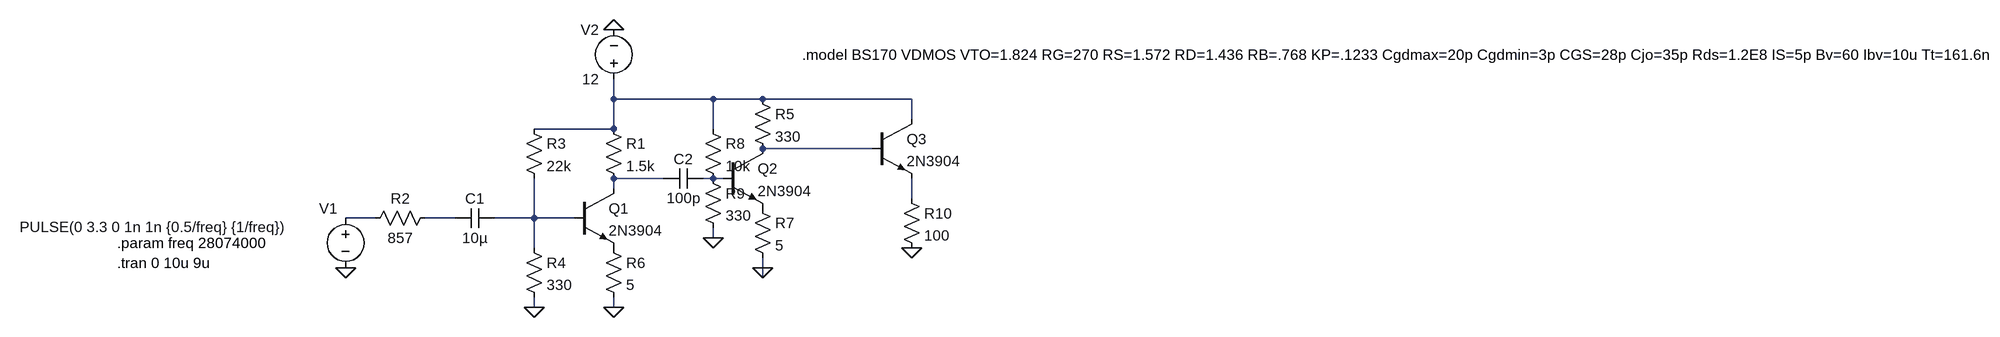
[diagram p0: schematic Draft2.asc]
Draft2.asc, the LTspice schematic file:
Version 4
SHEET 1 2568 680
WIRE 224 -48 224 -80
WIRE 384 -48 224 -48
WIRE 464 -48 384 -48
WIRE 704 -48 464 -48
WIRE 704 -16 704 -48
WIRE 224 0 224 -48
WIRE 224 0 96 0
WIRE 384 0 384 -48
WIRE 640 32 464 32
WIRE 304 80 224 80
WIRE 384 80 368 80
WIRE 400 80 384 80
WIRE 224 96 224 80
WIRE 704 112 704 80
WIRE -160 144 -208 144
WIRE -32 144 -80 144
WIRE 96 144 96 80
WIRE 96 144 32 144
WIRE 160 144 96 144
WIRE 384 176 384 160
WIRE 96 192 96 144
WIRE 464 224 464 208
WIRE 464 240 464 224
WIRE 96 288 96 272
WIRE 224 288 224 272
FLAG -208 224 0
FLAG 224 -160 0
FLAG 224 288 0
FLAG 96 288 0
FLAG 464 224 0
FLAG 384 176 0
FLAG 704 192 0
SYMBOL npn 160 96 R0
SYMATTR InstName Q1
SYMATTR Value 2N3904
SYMBOL res 208 -16 R0
SYMATTR InstName R1
SYMATTR Value 1.5k
SYMBOL voltage -208 128 R0
WINDOW 0 -43 0 Left 2
WINDOW 3 -525 30 Left 2
WINDOW 123 0 0 Left 0
WINDOW 39 0 0 Left 0
SYMATTR InstName V1
SYMATTR Value PULSE(0 3.3 0 1n 1n {0.5/freq} {1/freq})
SYMBOL voltage 224 -64 R180
WINDOW 0 24 96 Left 2
WINDOW 3 24 16 Left 2
WINDOW 123 0 0 Left 0
WINDOW 39 0 0 Left 0
SYMATTR InstName V2
SYMATTR Value 12
SYMBOL res 208 176 R0
SYMATTR InstName R6
SYMATTR Value 5
SYMBOL cap 32 128 R90
WINDOW 0 0 32 VBottom 2
WINDOW 3 32 32 VTop 2
SYMATTR InstName C1
SYMATTR Value 10µ
SYMBOL res -64 128 R90
WINDOW 0 0 56 VBottom 2
WINDOW 3 32 56 VTop 2
SYMATTR InstName R2
SYMATTR Value 857
SYMBOL res 80 -16 R0
SYMATTR InstName R3
SYMATTR Value 22k
SYMBOL res 80 176 R0
SYMATTR InstName R4
SYMATTR Value 330
SYMBOL npn 400 32 R0
SYMATTR InstName Q2
SYMATTR Value 2N3904
SYMBOL res 448 -64 R0
SYMATTR InstName R5
SYMATTR Value 330
SYMBOL res 448 112 R0
SYMATTR InstName R7
SYMATTR Value 5
SYMBOL cap 368 64 R90
WINDOW 0 0 32 VBottom 2
WINDOW 3 32 32 VTop 2
SYMATTR InstName C2
SYMATTR Value 100p
SYMBOL res 368 -16 R0
SYMATTR InstName R8
SYMATTR Value 10k
SYMBOL res 368 64 R0
SYMATTR InstName R9
SYMATTR Value 330
SYMBOL npn 640 -16 R0
SYMATTR InstName Q3
SYMATTR Value 2N3904
SYMBOL res 688 96 R0
SYMATTR InstName R10
SYMATTR Value 100
TEXT -576 216 Left 2 !.tran 0 10u 9u
TEXT -576 184 Left 2 !.param freq 28074000
TEXT 528 -120 Left 2 !.model BS170 VDMOS VTO=1.824 RG=270 RS=1.572 RD=1.436 RB=.768 KP=.1233 Cgdmax=20p Cgdmin=3p CGS=28p Cjo=35p Rds=1.2E8 IS=5p Bv=60 Ibv=10u Tt=161.6n

The netlist it stands for:
* Draft2.asc
Q1 N003 N008 P001 0 2N3904
R1 N001 N003 1.5k
V1 N006 0 PULSE(0 3.3 0 1n 1n {0.5/freq} {1/freq})
V2 N001 0 12
R6 P001 0 5
C1 N008 N007 10µ
R2 N007 N006 857
R3 N001 N008 22k
R4 N008 0 330
Q2 N002 N004 P002 0 2N3904
R5 N001 N002 330
R7 P002 0 5
C2 N004 N003 100p
R8 N001 N004 10k
R9 N004 0 330
Q3 N001 N002 N005 0 2N3904
R10 N005 0 100
.model NPN NPN
.model PNP PNP
.lib standard.bjt
.tran 0 10u 9u
.param freq 28074000
.model BS170 VDMOS VTO=1.824 RG=270 RS=1.572 RD=1.436 RB=.768 KP=.1233 Cgdmax=20p Cgdmin=3p CGS=28p Cjo=35p Rds=1.2E8 IS=5p Bv=60 Ibv=10u Tt=161.6n
.backanno
.end